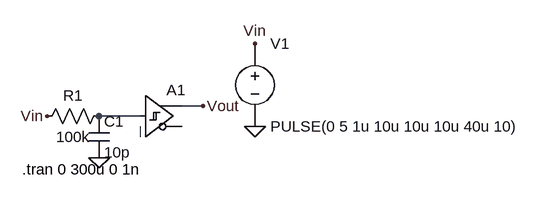
[diagram p0: schematic powerOnReset.asc]
powerOnReset.asc, the LTspice schematic file:
Version 4
SHEET 1 880 680
WIRE 320 112 288 112
WIRE 224 128 160 128
FLAG 160 192 0
FLAG 80 128 Vin
FLAG 320 112 Vout
FLAG 400 144 0
FLAG 400 16 Vin
SYMBOL res 176 112 R90
WINDOW 0 0 56 VBottom 2
WINDOW 3 32 56 VTop 2
SYMATTR InstName R1
SYMATTR Value 100k
SYMBOL cap 144 128 R0
SYMATTR InstName C1
SYMATTR Value 10p
SYMBOL Digital\\schmitt 224 64 R0
SYMATTR InstName A1
SYMBOL cktsym\\vsource 400 80 R0
WINDOW 123 0 0 Left 2
WINDOW 39 0 0 Left 2
SYMATTR Value PULSE(0 5 1u 10u 10u 10u 40u 10)
SYMATTR InstName V1
TEXT 42 210 Left 2 !.tran 0 300u 0 1n

The netlist it stands for:
* powerOnReset.asc
R1 N001 Vin 100k
C1 N001 0 10p
A1 N001 0 0 0 0 0 Vout 0 SCHMITT
V1 Vin 0 PULSE(0 5 1u 10u 10u 10u 40u 10)
.tran 0 300u 0 1n
.backanno
.end